# EasyEDA schematic AIO mère robotique V3.2-PcPortableDany.json
TITLE: AIO mère; REV: 1.0; Date: 2022-09-17; Sheet: 1/1; Drawn By: Fizzi_; Company: GameTeam 2023
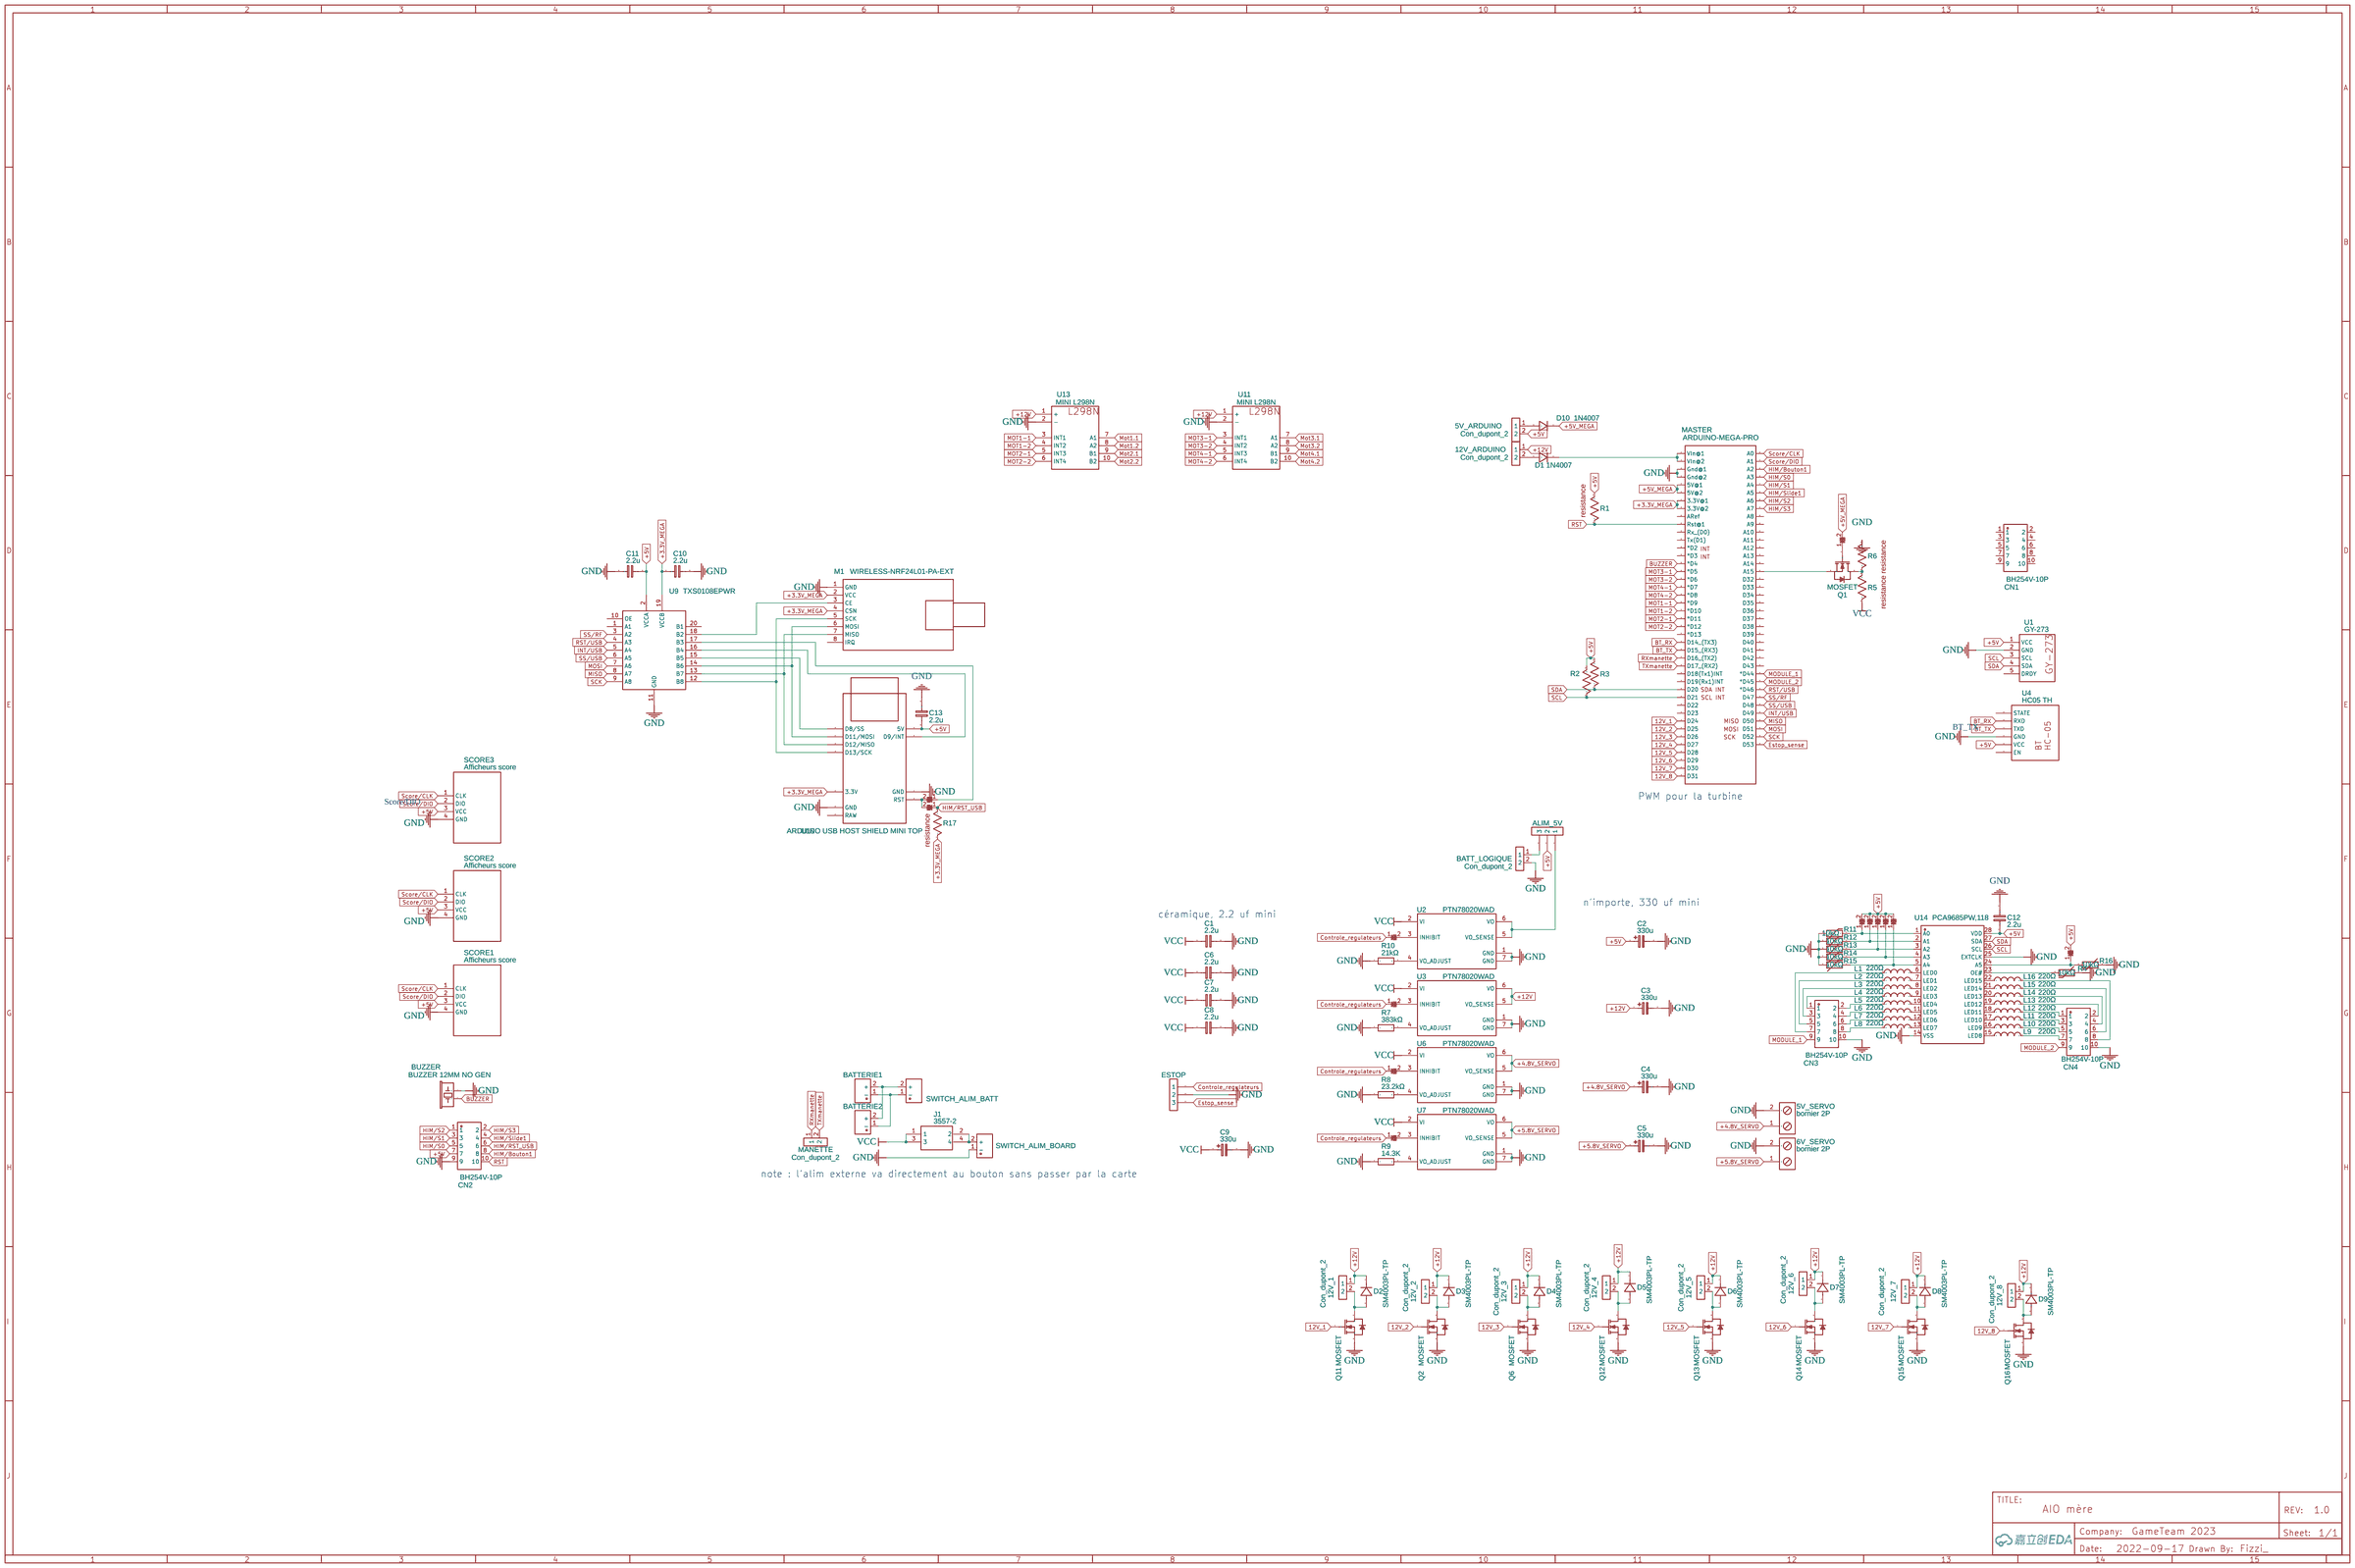
[diagram p0: schematic sheet]

## Parts
5V_ARDUINO  Con_dupont_2  [CON_DUPONT_2]
5V_SERVO  bornier 2P  [BORNIER 2P]
6V_SERVO  bornier 2P  [BORNIER 2P]
12V_1  Con_dupont_2  [CON_DUPONT_2]
12V_2  Con_dupont_2  [CON_DUPONT_2]
12V_3  Con_dupont_2  [CON_DUPONT_2]
12V_4  Con_dupont_2  [CON_DUPONT_2]
12V_5  Con_dupont_2  [CON_DUPONT_2]
12V_6  Con_dupont_2  [CON_DUPONT_2]
12V_7  Con_dupont_2  [CON_DUPONT_2]
12V_8  Con_dupont_2  [CON_DUPONT_2]
12V_ARDUINO  Con_dupont_2  [CON_DUPONT_2]
ALIM_5V  Dupont 3Pin  [DUPONT_3PTS]
BATT_LOGIQUE  Con_dupont_2  [CON_DUPONT_2]
BATTERIE1  XT60-M  [XT60-M]
BATTERIE2  XT60-M  [XT60-M]
BUZZER  BUZZER 12MM NO GEN  [BUZZER-12MM-NS]
BYPASS1  SolderJumper  [SOLDER-JUMPER-0603]
BYPASS2  SolderJumper  [SOLDER-JUMPER-0603]
BYPASS3  SolderJumper  [SOLDER-JUMPER-0603]
BYPASS4  SolderJumper  [SOLDER-JUMPER-0603]
BYPASS5  SolderJumper  [SOLDER-JUMPER-0603]
BYPASS6  SolderJumper  [SOLDER-JUMPER-0603]
BYPASS7  SolderJumper  [SOLDER-JUMPER-0603]
BYPASS8  SolderJumper  [SOLDER-JUMPER-0603]
BYPASS9  SolderJumper  [SOLDER-JUMPER-0603]
C1  2.2u  [C0805]
C2  330u  [CAP-D8.0×F3.5]
C3  330u  [CAP-D8.0×F3.5]
C4  330u  [CAP-D8.0×F3.5]
C5  330u  [CAP-D8.0×F3.5]
C6  2.2u  [C0805]
C7  2.2u  [C0805]
C8  2.2u  [C0805]
C9  330u  [CAP-D8.0×F3.5]
C10  2.2u  [C0805]
C11  2.2u  [C0805]
C12  2.2u  [C0805]
C13  2.2u  [C0805]
CN1  BH254V-10P  [IDC-TH_10P-P2.54-V-R2-C5-S2.54]
CN2  BH254V-10P  [IDC-TH_10P-P2.54-V-R2-C5-S2.54]
CN3  BH254V-10P  [IDC-TH_10P-P2.54-V-R2-C5-S2.54]
CN4  BH254V-10P  [IDC-TH_10P-P2.54-V-R2-C5-S2.54]
D1  1N4007  [DO-41_BD2.4-L4.7-P8.70-D0.9-RD]
D2  SM4003PL-TP  [SOD-123FL_L2.8-W1.7-LS3.6-RD]
D3  SM4003PL-TP  [SOD-123FL_L2.8-W1.7-LS3.6-RD]
D4  SM4003PL-TP  [SOD-123FL_L2.8-W1.7-LS3.6-RD]
D5  SM4003PL-TP  [SOD-123FL_L2.8-W1.7-LS3.6-RD]
D6  SM4003PL-TP  [SOD-123FL_L2.8-W1.7-LS3.6-RD]
D7  SM4003PL-TP  [SOD-123FL_L2.8-W1.7-LS3.6-RD]
D8  SM4003PL-TP  [SOD-123FL_L2.8-W1.7-LS3.6-RD]
D9  SM4003PL-TP  [SOD-123FL_L2.8-W1.7-LS3.6-RD]
D10  1N4007  [DO-41_BD2.4-L4.7-P8.70-D0.9-RD]
ENABP3  SolderJumper  [SOLDER-JUMPER-0603]
ENABP4  SolderJumper  [SOLDER-JUMPER-0603]
ENABP5  SolderJumper  [SOLDER-JUMPER-0603]
ENABP6  SolderJumper  [SOLDER-JUMPER-0603]
ESTOP  Dupont 3Pin  [DUPONT_3PTS]
J1  3557-2  [3557-2]
L1  220Ω  [L0603]
L2  220Ω  [L0603]
L3  220Ω  [L0603]
L4  220Ω  [L0603]
L5  220Ω  [L0603]
L6  220Ω  [L0603]
L7  220Ω  [L0603]
L8  220Ω  [L0603]
L9  220Ω  [L0603]
L10  220Ω  [L0603]
L11  220Ω  [L0603]
L12  220Ω  [L0603]
L13  220Ω  [L0603]
L14  220Ω  [L0603]
L15  220Ω  [L0603]
L16  220Ω  [L0603]
M1  WIRELESS-NRF24L01-PA-EXT  [WIRELESS-NRF24L01-PA-EXT]
MANETTE  Con_dupont_2  [CON_DUPONT_2]
MASTER  ARDUINO-MEGA-PRO  [ARDUINO-MEGA-PRO-MINI]
Q1  MOSFET  [MOSFET-TO-220]
Q2  MOSFET  [MOSFET-TO-220]
Q6  MOSFET  [MOSFET-TO-220]
Q11  MOSFET  [MOSFET-TO-220]
Q12  MOSFET  [MOSFET-TO-220]
Q13  MOSFET  [MOSFET-TO-220]
Q14  MOSFET  [MOSFET-TO-220]
Q15  MOSFET  [MOSFET-TO-220]
Q16  MOSFET  [MOSFET-TO-220]
R1  1K  [TROUGH HOLE RESISTOR 12MM]
R2  1K  [TROUGH HOLE RESISTOR 12MM]
R3  1K  [TROUGH HOLE RESISTOR 12MM]
R4  10kΩ  [R0603]
R5  1K  [TROUGH HOLE RESISTOR 12MM]
R6  1K  [TROUGH HOLE RESISTOR 12MM]
R7  383kΩ  [R0603]
R8  23.2kΩ  [R0603]
R9  14.3K  [R0603]
R10  21kΩ  [R0603]
R11  10kΩ  [R0603]
R12  10kΩ  [R0603]
R13  10kΩ  [R0603]
R14  10kΩ  [R0603]
R15  10kΩ  [R0603]
R16  10kΩ  [R0603]
R17  1K  [TROUGH HOLE RESISTOR 12MM]
SCORE1  Afficheurs score  [GROVE-2MM-4PIN-I2C]
SCORE2  Afficheurs score  [GROVE-2MM-4PIN-I2C]
SCORE3  Afficheurs score  [GROVE-2MM-4PIN-I2C]
SWITCH_ALIM_BATT  XT60-M  [XT60-M]
SWITCH_ALIM_BOARD  XT60-M  [XT60-M]
U1  GY-273  [GY-273]
U2  PTN78020WAD  [TI-EUK7_V]
U3  PTN78020WAD  [TI-EUK7_V]
U4  HC05 TH  [HC05 TH]
U6  PTN78020WAD  [TI-EUK7_V]
U7  PTN78020WAD  [TI-EUK7_V]
U9  TXS0108EPWR  [TSSOP-20_L6.5-W4.4-P0.65-LS6.4-BL]
U10  ARDUINO USB HOST SHIELD MINI TOP  [ARDUINO USB HOST SHIELD MINI - TOP]
U11  MINI L298N  [MINI-L298N]
U13  MINI L298N  [MINI-L298N]
U14  PCA9685PW,118  [TSSOP-28_L9.7-W4.4-P0.65-LS6.4-TL]

## Library data of the parts
5V_ARDUINO 12V_1-12V_8 12V_ARDUINO BATT_LOGIQUE MANETTE = Con_dupont_2: Contributor: Christian GILSON
5V_SERVO 6V_SERVO = bornier 2P: Manufacturer Part: bornier; Contributor: BPAI; Supplier Part: https://fr.aliexpress.com/item/10pcs-2-Poles-2-Pin-2-54mm-0-1-PCB-Universal-Screw-Terminal-Block-Connector-Free/32556311867.html?spm=a2g0s.12269583.0.0.52167213yanoYJ
ALIM_5V ESTOP = Dupont 3Pin: Contributor: tomsouthtrader
BATTERIE1 BATTERIE2 SWITCH_ALIM_BATT SWITCH_ALIM_BOARD = XT60-M: Supplier: LCSC; Supplier Part: C2918078; Manufacturer Part: XT60UPB-M; JLCPCB Part Class: Extended Part; Contributor: LCSC
BUZZER = BUZZER 12MM NO GEN: Contributor: SparkFun
BYPASS1-BYPASS9 ENABP3-ENABP6 = SolderJumperSmd6030: Contributor: gorjan.dzundev
C1 C6-C8 C10-C13 = C_0805_EU: Contributor: LCEDA_Lib
C2-C5 C9 = CE_TH_D8.0×F3.5_EU: Contributor: LCEDA_Lib
CN1-CN4 = BH254V-10P: Supplier: LCSC; Supplier Part: C492442; Manufacturer: XFCN(兴飞); Contributor: LCSC; JLCPCB Part Class: Extended Part
D1 D10 = 1N4007: Supplier: LCSC; Manufacturer: SEMTECH; Supplier Part: C106903; Contributor: LCEDA_Lib
D2-D9 = SM4003PL-TP: Supplier: LCSC; Supplier Part: C725472; Manufacturer: MCC(美微科); Contributor: LCSC; JLCPCB Part Class: Extended Part
J1 = 3557-2: Contributor: Stampolidis
L1-L16 = BLM18SG221TN1D: Supplier: LCSC; Manufacturer: muRata(村田); Supplier Part: C88988; JLCPCB Part Class: Extended Part
M1 = WIRELESS-NRF24L01-PA-EXT: 2.4 GHz Wireless Module based on NRF24L01 chip with preamplifier and external antenna
MASTER = ARDUINO-MEGA-PRO COPY: Manufacturer Part: ARDUINO MEGA 2560 PRO EMBED; Contributor: Tony Sloos; subpart_no: 1
Q1 Q2 Q6 Q11-Q16 = MOSFET: image: //image.lceda.cn/szlcsc/C2561.jpg; Contributor: LCSC
R1-R3 R5 R6 R17 = TROUGH HOLE RESISTOR 12MM: Contributor: delvingt.julien
R4 R11-R16 = SDNT1608X103J3450HTF: Supplier: LCSC; Manufacturer: Sunlord(顺络); Supplier Part: C43113; JLCPCB Part Class: Extended Part
R7 = TR0603D383KP0515: Supplier: LCSC; Supplier Part: C153382; Manufacturer: EVER OHMS(天二科技); Resistance (Ohms): 383K; Contributor: LCSC; JLCPCB Part Class: Extended Part
R8 = 0603WAF2322T5E: Supplier: LCSC; Manufacturer: UNI-ROYAL(厚声); Supplier Part: C23346; Resistance (Ohms): 23.2K; JLCPCB Part Class: Extended Part
R9 = AC0603FR-0714K3L: Supplier: LCSC; Supplier Part: C227592; Manufacturer: YAGEO(国巨); Contributor: LCSC; JLCPCB Part Class: Extended Part; Resistance: 14.3kΩ
R10 = HPCR0603F21K0K9: Supplier: LCSC; Supplier Part: C365119; Manufacturer: RESI(开步睿思）; Resistance (Ohms): 21K; Contributor: LCSC; JLCPCB Part Class: Extended Part
SCORE1-SCORE3 = GROVE-2MM-4PIN-I2C: Contributor: arunprakash.ec20
U1 = GY-273: Contributor: Андрей Скиффи
U2 U3 U6 U7 = PTN78020WAD: 6 A Wide-Input Voltage Adjustable Switching Regulator, -40 to 85 degC, 7-pin Module (EUK7), Pb-Free (RoHS)
U4 = HC05 TH: Contributor: hdutton
U9 = TXS0108EPWR: Supplier: LCSC; Manufacturer: TI(德州仪器); Supplier Part: C17206; JLCPCB Part Class: Extended Part
U10 = ARDUINO USB HOST SHIELD MINI TOP: sourceId: KGSeAWhDB; Contributor: moddosan
U11 U13 = MINI L298N: Contributor: Dezcript
U14 = PCA9685PW,118: Supplier: LCSC; Supplier Part: C2678753; Manufacturer: NXP(恩智浦); link: https://atta.szlcsc.com//upload/public/pdf/source/20170908/C92206_1504870161626958140.pdf; JLCPCB Part Class: Extended Part; Contributor: LCSC

## Nets
12V_1: MASTER.35(D24) Q11.1(G)
12V_2: MASTER.36(D25) Q2.1(G)
12V_3: MASTER.37(D26) Q6.1(G)
12V_4: MASTER.38(D27) Q12.1(G)
12V_5: MASTER.39(D28) Q13.1(G)
12V_6: MASTER.40(D29) Q14.1(G)
12V_7: MASTER.41(D30) Q15.1(G)
12V_8: MASTER.42(D31) Q16.1(G)
+3.3V_MEGA: C10.1 M1.2(VCC) M1.4(CSN) MASTER.7(3.3V@1) MASTER.8(3.3V@2) R17.1 U9.19(VCCB) U10.21(3.3V)
+4.8V_SERVO: 5V_SERVO.1 C4.1 U6.5(VO SENSE) U6.6(VO)
+5.8V_SERVO: 6V_SERVO.1 C5.1 U7.5(VO SENSE) U7.6(VO)
+5V: 5V_ARDUINO.2 ALIM_5V.2 BYPASS1.2 BYPASS3.2 BYPASS4.2 BYPASS5.2 BYPASS6.2 BYPASS7.2 C2.1 C11.2 C12.1 C13.1 CN2.7 R1.2 R2.2 R3.2 SCORE1.3(VCC) SCORE2.3(VCC) SCORE3.3(VCC) U1.1(VCC) U4.2(VCC) U9.2(VCCA) U10.25(5V) U14.28(VDD)
+5V_MEGA: BYPASS2.2 D10.1 MASTER.5(5V@1) MASTER.6(5V@2)
+12V: 12V_1.1 12V_2.1 12V_3.1 12V_4.1 12V_5.1 12V_6.1 12V_7.1 12V_8.1 12V_ARDUINO.1 C3.1 D2.1(K) D3.1(K) D4.1(K) D5.1(K) D6.1(K) D7.1(K) D8.1(K) D9.1(K) U3.5(VO SENSE) U3.6(VO) U11.1(+) U13.1(+)
GND: 5V_SERVO.2 6V_SERVO.2 BATT_LOGIQUE.2 BUZZER.-(2) C1.2 C2.2 C3.2 C4.2 C5.2 C6.2 C7.2 C8.2 C9.2 C10.2 C11.1 C12.2 C13.2 CN2.9 CN3.10 CN4.10 ESTOP.2 M1.1(GND) MASTER.3(Gnd@1) MASTER.4(Gnd@2) Q2.3(S) Q6.3(S) Q11.3(S) Q12.3(S) Q13.3(S) Q14.3(S) Q15.3(S) Q16.3(S) R4.2 R6.2 R7.1 R8.1 R9.1 R10.1 R11.2 R12.2 R13.2 R14.2 R15.2 R16.2 SCORE1.4(GND) SCORE2.4(GND) SCORE3.4(GND) SWITCH_ALIM_BOARD.1(-) U1.2(GND) U2.1(GND) U2.7(GND) U3.1(GND) U3.7(GND) U4.3(GND) U6.1(GND) U6.7(GND) U7.1(GND) U7.7(GND) U9.11(GND) U10.4(GND) U10.23(GND) U11.2(-) U13.2(-) U14.14(VSS) U14.25(EXTCLK)
VCC: C1.1 C6.1 C7.1 C8.1 C9.1 J1.1 J1.3 R5.1 U2.2(VI) U3.2(VI) U6.2(VI) U7.2(VI)
BT_RX: MASTER.25(D14 (TX3)) U4.5(RXD)
BT_TX: MASTER.26(D15 (RX3)) U4.4(TXD)
BUZZER: BUZZER.+(1) MASTER.15(*D4)
Controle_regulateurs: ENABP3.1 ENABP4.1 ENABP5.1 ENABP6.1 ESTOP.1
Estop_sense: ESTOP.3 MASTER.80(D53)
HIM/Bouton1: CN2.8 MASTER.45(A2)
HIM/RST_USB: BYPASS9.1 CN2.6 R17.2
HIM/S0: CN2.5 MASTER.46(A3)
HIM/S1: CN2.3 MASTER.47(A4)
HIM/S2: CN2.1 MASTER.49(A6)
HIM/S3: CN2.2 MASTER.50(A7)
HIM/Slide1: CN2.4 MASTER.48(A5)
INT/USB: MASTER.76(D49) U9.5(A4)
MISO: MASTER.77(D50) U9.8(A7)
MODULE_1: CN3.9 MASTER.71(*D44)
MODULE_2: CN4.9 MASTER.72(*D45)
MOSI: MASTER.78(D51) U9.7(A6)
MOT1-1: MASTER.20(*D9) U13.3(INT1)
MOT1-2: MASTER.21(*D10) U13.4(INT2)
Mot1.1: U13.7(A1)
Mot1.2: U13.8(A2)
MOT2-1: MASTER.22(*D11) U13.5(INT3)
MOT2-2: MASTER.23(*D12) U13.6(INT4)
Mot2.1: U13.9(B1)
Mot2.2: U13.10(B2)
MOT3-1: MASTER.16(*D5) U11.3(INT1)
MOT3-2: MASTER.17(*D6) U11.4(INT2)
Mot3.1: U11.7(A1)
Mot3.2: U11.8(A2)
MOT4-1: MASTER.18(*D7) U11.5(INT3)
MOT4-2: MASTER.19(*D8) U11.6(INT4)
Mot4.1: U11.9(B1)
Mot4.2: U11.10(B2)
RST: CN2.10 MASTER.10(Rst@1) R1.1
RST/USB: MASTER.73(*D46) U9.4(A3)
RXmanette: MANETTE.1 MASTER.27(D16 (TX2))
SCK: MASTER.79(D52) U9.9(A8)
SCL: MASTER.32(D21) R2.1 U1.3(SCL) U14.26(SCL)
Score/CLK: MASTER.43(A0) SCORE1.1(CLK) SCORE2.1(CLK) SCORE3.1(CLK)
Score/DIO: MASTER.44(A1) SCORE1.2(DIO) SCORE2.2(DIO) SCORE3.2(DIO)
SDA: MASTER.31(D20) R3.1 U1.4(SDA) U14.27(SDA)
SS/RF: MASTER.74(D47) U9.3(A2)
SS/USB: MASTER.75(D48) U9.6(A5)
TXmanette: MANETTE.2 MASTER.28(D17 (RX2))
Net-(5V_ARDUINO-1): 5V_ARDUINO.1 D10.2
Net-(12V_1-2): 12V_1.2 D2.2(A) Q11.2(D)
Net-(12V_2-2): 12V_2.2 D3.2(A) Q2.2(D)
Net-(12V_3-2): 12V_3.2 D4.2(A) Q6.2(D)
Net-(12V_4-2): 12V_4.2 D5.2(A) Q12.2(D)
Net-(12V_5-2): 12V_5.2 D6.2(A) Q13.2(D)
Net-(12V_6-2): 12V_6.2 D7.2(A) Q14.2(D)
Net-(12V_7-2): 12V_7.2 D8.2(A) Q15.2(D)
Net-(12V_8-2): 12V_8.2 D9.2(A) Q16.2(D)
Net-(12V_ARDUINO-2): 12V_ARDUINO.2 D1.2
Net-(ALIM_5V-1): ALIM_5V.1 U2.5(VO SENSE) U2.6(VO)
Net-(ALIM_5V-3): ALIM_5V.3 BATT_LOGIQUE.1
Net-(BATTERIE1-1): BATTERIE1.1(-) BATTERIE2.1(-) SWITCH_ALIM_BATT.1(-)
Net-(BATTERIE1-2): BATTERIE1.2(+) BATTERIE2.2(+) SWITCH_ALIM_BATT.2(+)
Net-(BYPASS1-1): BYPASS1.1 R11.1 U14.1(A0)
Net-(BYPASS2-1): BYPASS2.1 Q1.1(G)
Net-(BYPASS3-1): BYPASS3.1 R12.1 U14.2(A1)
Net-(BYPASS4-1): BYPASS4.1 R13.1 U14.3(A2)
Net-(BYPASS5-1): BYPASS5.1 R14.1 U14.4(A3)
Net-(BYPASS6-1): BYPASS6.1 R15.1 U14.5(A4)
Net-(BYPASS7-1): BYPASS7.1 R16.1 U14.24(A5)
Net-(BYPASS8-1): BYPASS8.1 U9.17(B3)
Net-(BYPASS8-2): BYPASS8.2 BYPASS9.2 U10.3(RST)
Net-(CN3-1): CN3.1 L4.1
Net-(CN3-2): CN3.2 L5.1
Net-(CN3-3): CN3.3 L3.1
Net-(CN3-4): CN3.4 L6.1
Net-(CN3-5): CN3.5 L2.1
Net-(CN3-6): CN3.6 L7.1
Net-(CN3-7): CN3.7 L1.1
Net-(CN3-8): CN3.8 L8.1
Net-(CN4-1): CN4.1 L12.2
Net-(CN4-2): CN4.2 L13.2
Net-(CN4-3): CN4.3 L11.2
Net-(CN4-4): CN4.4 L14.2
Net-(CN4-5): CN4.5 L10.2
Net-(CN4-6): CN4.6 L15.2
Net-(CN4-7): CN4.7 L9.2
Net-(CN4-8): CN4.8 L16.2
Net-(D1-1): D1.1 MASTER.1(VIn@1) MASTER.2(VIn@2)
Net-(ENABP3-2): ENABP3.2 U2.3(INHIBIT)
Net-(ENABP4-2): ENABP4.2 U3.3(INHIBIT)
Net-(ENABP5-2): ENABP5.2 U6.3(INHIBIT)
Net-(ENABP6-2): ENABP6.2 U7.3(INHIBIT)
Net-(J1-2): J1.2 J1.4 SWITCH_ALIM_BOARD.2(+)
Net-(L1-2): L1.2 U14.6(LED0)
Net-(L2-2): L2.2 U14.7(LED1)
Net-(L3-2): L3.2 U14.8(LED2)
Net-(L4-2): L4.2 U14.9(LED3)
Net-(L5-2): L5.2 U14.10(LED4)
Net-(L6-2): L6.2 U14.11(LED5)
Net-(L7-2): L7.2 U14.12(LED6)
Net-(L8-2): L8.2 U14.13(LED7)
Net-(L9-1): L9.1 U14.15(LED8)
Net-(L10-1): L10.1 U14.16(LED9)
Net-(L11-1): L11.1 U14.17(LED10)
Net-(L12-1): L12.1 U14.18(LED11)
Net-(L13-1): L13.1 U14.19(LED12)
Net-(L14-1): L14.1 U14.20(LED13)
Net-(L15-1): L15.1 U14.21(LED14)
Net-(L16-1): L16.1 U14.22(LED15)
Net-(M1-3): M1.3(CE) U9.18(B2)
Net-(M1-5): M1.5(SCK) U9.12(B8) U10.16(D13/SCK)
Net-(M1-6): M1.6(MOSI) U9.14(B6) U10.14(D11/MOSI)
Net-(M1-7): M1.7(MISO) U9.13(B7) U10.15(D12/MISO)
Net-(MASTER-58): MASTER.58(A15) Q1.3(S)
Net-(Q1-2): Q1.2(D) R5.2 R6.1
Net-(R4-1): R4.1 U14.23(OE#)
Net-(R7-2): R7.2 U3.4(VO ADJUST)
Net-(R8-2): R8.2 U6.4(VO ADJUST)
Net-(R9-2): R9.2 U7.4(VO ADJUST)
Net-(R10-2): R10.2 U2.4(VO ADJUST)
Net-(U9-15): U9.15(B5) U10.13(D8/SS)
Net-(U9-16): U9.16(B4) U10.12(D9/INT)

Not connected (* = marked no-connect by the designer): CN1 1 2 3 4 5 6 7 8 9 10; M1 8(IRQ); MASTER 9(ARef) 11(Rx (D0)) 12(Tx(D1)) 13(*D2) 14(*D3) 24(*D13) 29(D18(Tx1)INT) 30(D19(Rx1)INT) 33(D22) 34(D23) 51(A8) 52(A9) 53(A10) 54(A11) 55(A12) 56(A13) 57(A14) 59(D32) 60(D33) 61(D34) 62(D35) 63(D36) 64(D37) 65(D38) 66(D39) 67(D40) 68(D41) 69(D42) 70(D43); U1 5(DRDY); U4 1(EN) 6(STATE); U9 1(A1) 10(OE) 20(B1); U10 24(RAW)

## Notes on the sheet
- BT_TX
- PWM pour la turbine
- Score/DIO
- n'importe, 330 uf mini
- céramique, 2.2 uf mini
- note : l'alim externe va directement au bouton sans passer par la carte
